# EAGLE design GPS-IoT-Mezzanine (EAGLE 9.6.2)
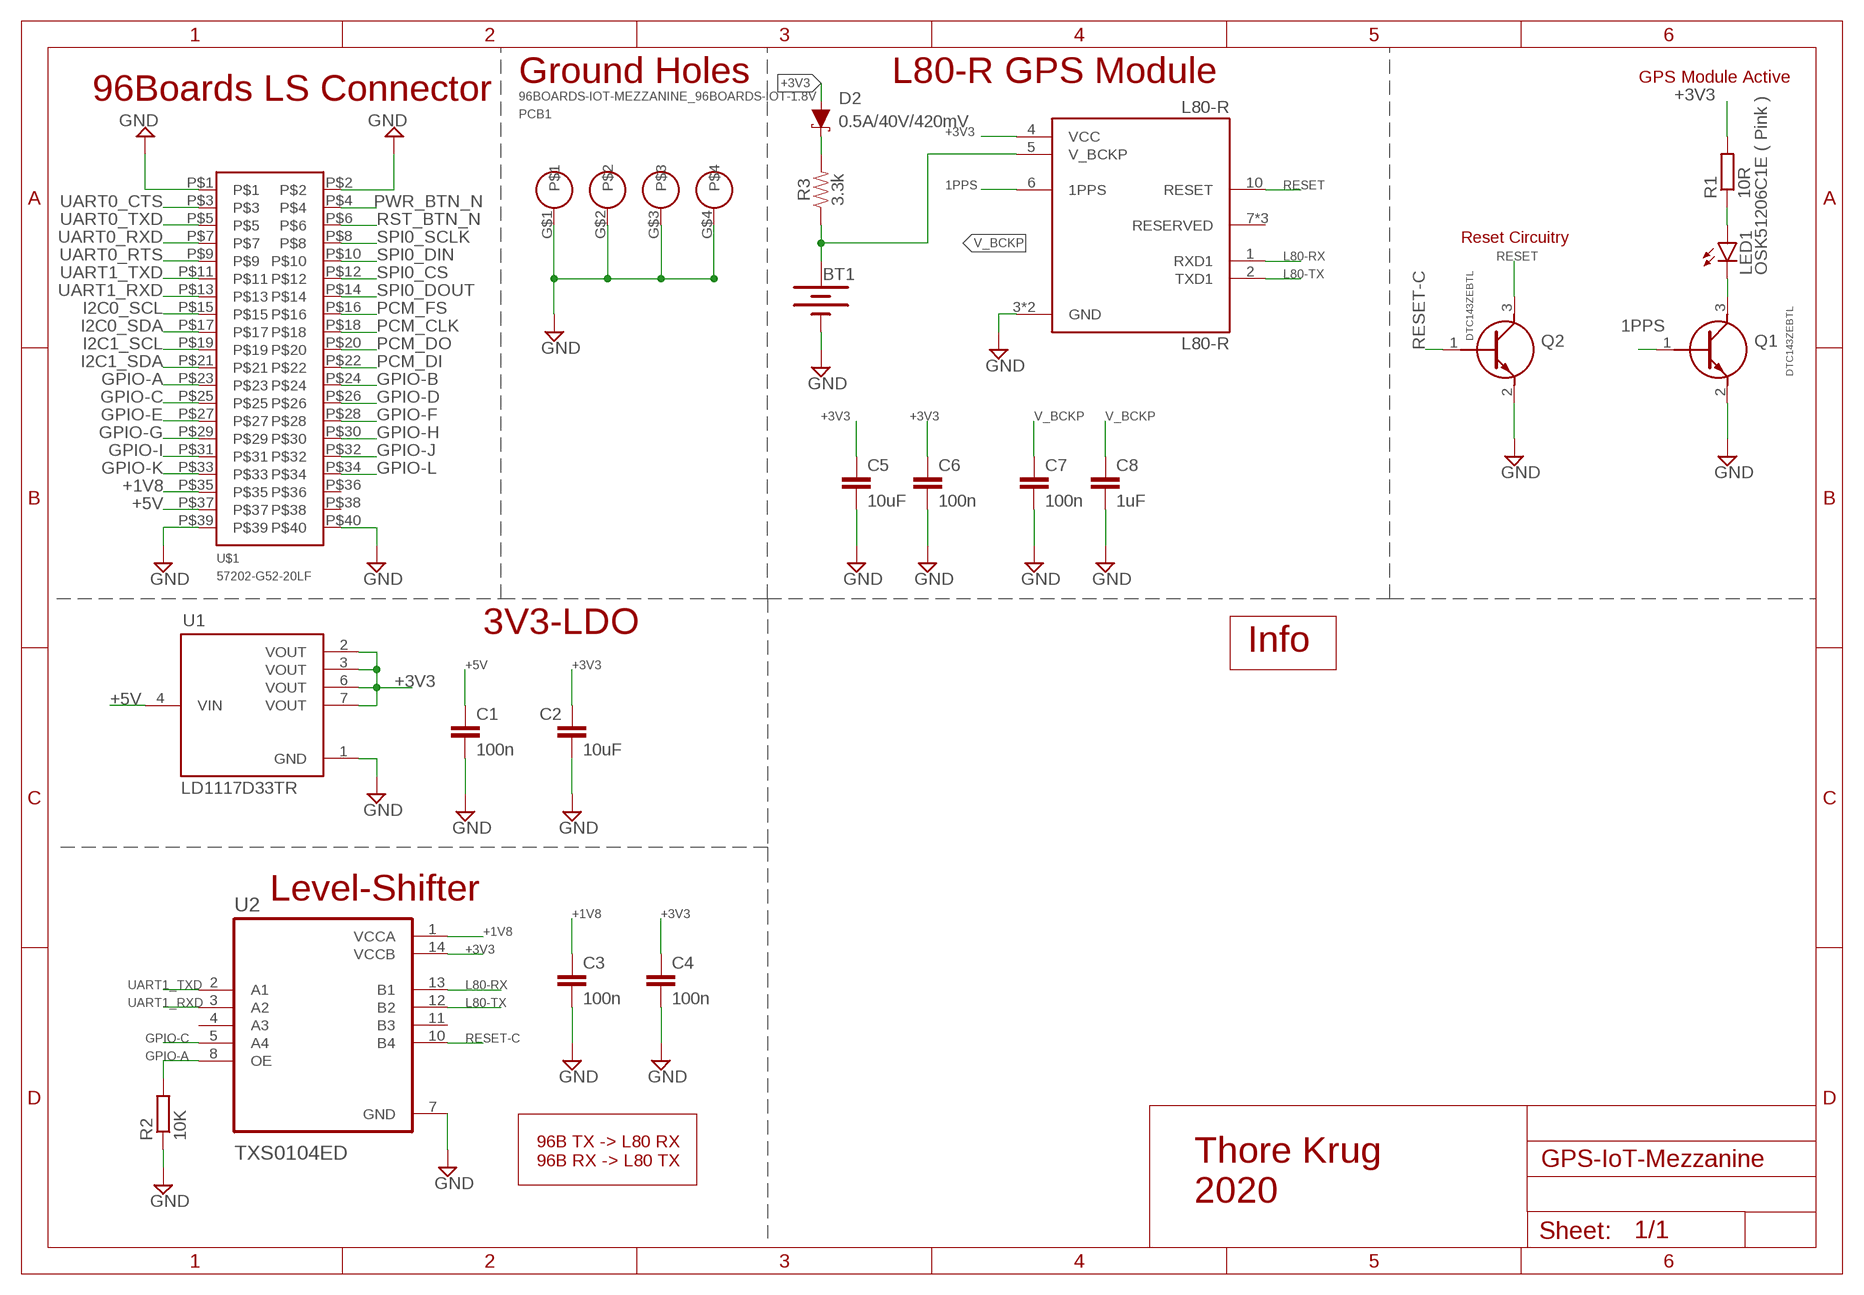
[diagram p0: schematic, sheet 1]

## Parts
BT1  6.8MM_COIN_CELL  ML414H_IV01E_BATTERY  [ML414H_IV01E]
C1  100n  C-EUC0603  [C0603]
C2  10uF  C-EUC0603  [C0603]
C3  100n  C-EUC0603  [C0603]
C4  100n  C-EUC0603  [C0603]
C5  10uF  C-EUC0603  [C0603]
C6  100n  C-EUC0603  [C0603]
C7  100n  C-EUC0603  [C0603]
C8  1uF  C-EUC0603  [C0603]
D2  0.5A/40V/420mV  DIODE-SCHOTTKY-PMEG4005EJ  [SOD-323]
L80-R  L80-R  [XCVR_L80-R]
LED1  OSK51206C1E ( Pink )  LEDCHIPLED_1206  [CHIPLED_1206]
PCB1  96BOARDS-IOT-MEZZANINE_96BOARDS-IOT-1.8V  [96BOARDS-IOT-MEZZANINE_96BOARDS-IOT-1.8V]
Q1  DTC143ZEBTL  [SOTFL50P160X85-3N]
Q2  DTC143ZEBTL  [SOTFL50P160X85-3N]
R1  10R  R-EU_R1206  [R1206]
R2  10K  R-EU_R0603  [R0603]
R3  3.3k  3.3KOHM-0603-1/10W-1%  [0603]
U1  LD1117D33TR  [SOIC127P600X175-8N]
U2  TXS0104ED  [SOIC127P600X175-14N]
U$1  57202-G52-20LF  [57202-G52-20LF]

## Nets
1PPS: L80-R.6(1PPS) Q1.1(B)
+1V8: C3.1 U2.1(VCCA) U$1.P$35
+3V3: C2.1 C4.1 C5.1 C6.1 D2.A L80-R.4(VCC) R1.2 U1.2(VOUT) U1.3(VOUT) U1.6(VOUT) U1.7(VOUT) U2.14(VCCB)
+5V: C1.1 U1.4(VIN) U$1.P$37
GND: BT1.- C1.2 C2.2 C3.2 C4.2 C5.2 C6.2 C7.2 C8.2 L80-R.3(GND) L80-R.12(GND) PCB1.G$1 PCB1.G$2 PCB1.G$3 PCB1.G$4 Q1.2(E) Q2.2(E) R2.1 U1.1(GND) U2.7(GND) U$1.P$1 U$1.P$2 U$1.P$39 U$1.P$40
GPIO-A: R2.2 U2.8(OE) U$1.P$23
GPIO-B: U$1.P$24
GPIO-C: U2.5(A4) U$1.P$25
GPIO-D: U$1.P$26
GPIO-E: U$1.P$27
GPIO-F: U$1.P$28
GPIO-G: U$1.P$29
GPIO-H: U$1.P$30
GPIO-I: U$1.P$31
GPIO-J: U$1.P$32
GPIO-K: U$1.P$33
GPIO-L: U$1.P$34
I2C0_SCL: U$1.P$15
I2C0_SDA: U$1.P$17
I2C1_SCL: U$1.P$19
I2C1_SDA: U$1.P$21
L80-RX: L80-R.1(RXD1) U2.13(B1)
L80-TX: L80-R.2(TXD1) U2.12(B2)
N$3: LED1.C Q1.3(C)
N$4: LED1.A R1.1
N$6: D2.C R3.2
PCM_CLK: U$1.P$18
PCM_DI: U$1.P$22
PCM_DO: U$1.P$20
PCM_FS: U$1.P$16
PWR_BTN_N: U$1.P$4
RESET: L80-R.10(RESET) Q2.3(C)
RESET-C: Q2.1(B) U2.10(B4)
RST_BTN_N: U$1.P$6
SPI0_CS: U$1.P$12
SPI0_DIN: U$1.P$10
SPI0_DOUT: U$1.P$14
SPI0_SCLK: U$1.P$8
UART0_CTS: U$1.P$3
UART0_RTS: U$1.P$9
UART0_RXD: U$1.P$7
UART0_TXD: U$1.P$5
UART1_RXD: U2.3(A2) U$1.P$13
UART1_TXD: U2.2(A1) U$1.P$11
V_BCKP: BT1.+ C7.1 C8.1 L80-R.5(V_BCKP) R3.1
Unconnected: L80-R.7(RESERVED) L80-R.8(RESERVED) L80-R.11(RESERVED) U2.4(A3) U2.11(B3) U$1.P$36 U$1.P$38

## Notes on the sheet
- Ground Holes | L80-R GPS Module | GPS Module Active
- 96Boards LS Connector
- Reset Circuitry
- 3V3-LDO
- Info
- Level-Shifter
- 96B TX -> L80 RX
  96B RX -> L80 TX
- Thore Krug 
  2020

## Library data of the parts
BT1 = SparkFun-Batteries:ML414H_IV01E_BATTERY: SEIKO ML414H-IV01E Reflowable Lithium Battery ML414H is a rechargeable, coin type battery with features such as Pb-free reflowable (Peak temperature: 260 C) and high temperature heat resistance. Battery Characteristics: 3.1V max voltage Voff is 2V 1mAH 3k series resistor with battery 72 hour charge time from 2.0-3.1V 2.3-2.8V initial charge; PROD_ID: BATT-14267
C1-C8 = rcl:C-EU: CAPACITOR, European symbol; SPICEPREFIX: C
D2 = SparkFun-DiscreteSemi:DIODE-SCHOTTKY: Schottky diode A Schottky diode is a semiconductor diode which has a low forward voltage drop and a very fast switching action.; PROD_ID: DIO-10955
L80-R = L80-R:L80-R; AVAILABILITY: Unavailable; DESCRIPTION: L80-R is an ultra compact GPS POT (Patch on Top) module with an embedded 15.0mm × 15.0mm × 4.0mm patch antenna; MF: Quectel; MP: L80-R; PACKAGE: None; PRICE: None
LED1 = led:LED: LED OSRAM: - CHIPLED LG R971, LG N971, LY N971, LG Q971, LY Q971, LO R971, LY R971 LH N974, LH R974 LS Q976, LO Q976, LY Q976 LO Q996 - Hyper CHIPLED LW Q18S LB Q993, LB Q99A, LB R99A - SideLED LS A670, LO A670, LY A670, LG A670, LP A670 LB A673, LV A673, LT A673, LW A673 LH A674 LY A675 LS A676, LA A676, LO A676, LY A676, LW A676 LS A679, LY A679, LG A679 - Hyper Micro SIDELED® LS Y876, LA Y876, LO Y876, LY Y876 LT Y87S - SmartLED LW L88C, LW L88S LB L89C, LB L89S, LG L890 LS L89K, LO L89K, LY L89K LS L896, LA L896, LO L896, LY L896 - TOPLED LS T670, LO T670, LY T670, LG T670, LP T670 LSG T670, LSP T670, LSY T670, LOP T670, LYG T670 LG T671, LOG T671, LSG T671 LB T673, LV T673, LT T673, LW T673 LH T674 LS T676, LA T676, LO T676, LY T676, LB T676, LH T676, LSB T676, LW T676 LB T67C, LV T67C, LT T67C, LS T67K, LO T67K, LY T67K, LW E67C LS E67B, LA E67B, LO E67B, LY E67B, LB E67C, LV E67C, LT E67C LW T67C LS T679, LY T679, LG T679 LS T770, LO T770, LY T770, LG T770, LP T770 LB T773, LV T773, LT T773, LW T773 LH T774 LS E675, LA E675, LY E675, LS T675 LS T776, LA T776, LO T776, LY T776, LB T776 LHGB T686 LT T68C, LB T68C - Hyper Mini TOPLED® LB M676 - Mini TOPLED Santana® LG M470 LS M47K, LO M47K, LY M47K Source: http://www.osram.convergy.de LUXEON: - LUMILED® LXK2-PW12-R00, LXK2-PW12-S00, LXK2-PW14-U00, LXK2-PW14-V00 LXK2-PM12-R00, LXK2-PM12-S00, LXK2-PM14-U00 LXK2-PE12-Q00, LXK2-PE12-R00, LXK2-PE12-S00, LXK2-PE14-T00, LXK2-PE14-U00 LXK2-PB12-K00, LXK2-PB12-L00, LXK2-PB12-M00, LXK2-PB14-N00, LXK2-PB14-P00, LXK2-PB14-Q00 LXK2-PR12-L00, LXK2-PR12-M00, LXK2-PR14-Q00, LXK2-PR14-R00 LXK2-PD12-Q00, LXK2-PD12-R00, LXK2-PD12-S00 LXK2-PH12-R00, LXK2-PH12-S00 LXK2-PL12-P00, LXK2-PL12-Q00, LXK2-PL12-R00 Source: www.luxeon.com KINGBRIGHT: KA-3528ASYC Source: www.kingbright.com
PCB1 = GPS-IoT-Mezzanine:96BOARDS-IOT-MEZZANINE_96BOARDS-IOT-1.8V
Q1 Q2 = SamacSys_Parts:DTC143ZEBTL: ROHM, DTC143ZEBTL NPN Digital Transistor, 100 mA 50 V 4.7 k, Ratio Of 10, 3-Pin SC-89 Source: Datasheet <https://www.rohm.com/datasheet/DTC143ZEB/dtc143zebtl-e>; ARROW_PART_NUMBER: DTC143ZEBTL; ARROW_PRICE-STOCK: https://www.arrow.com/en/products/dtc143zebtl/rohm-semiconductor; DESCRIPTION: ROHM, DTC143ZEBTL NPN Digital Transistor, 100 mA 50 V 4.7 k, Ratio Of 10, 3-Pin SC-89; HEIGHT: 0.85mm; MANUFACTURER_NAME: ROHM Semiconductor; MANUFACTURER_PART_NUMBER: DTC143ZEBTL; MOUSER_PART_NUMBER: 755-DTC143ZEBTL; MOUSER_PRICE-STOCK: https://www.mouser.co.uk/ProductDetail/ROHM-Semiconductor/DTC143ZEBTL?qs=IsRgwgmxh6%252Bn%252Bp0edl8N%2Fw%3D%3D
R1 R2 = rcl:R-EU_: RESISTOR, European symbol; SPICEPREFIX: R
R3 = SparkFun-Resistors:3.3KOHM: 3.3kΩ resistor A resistor is a passive two-terminal electrical component that implements electrical resistance as a circuit element. Resistors act to reduce current flow, and, at the same time, act to lower voltage levels within circuits. - Wikipedia; PROD_ID: RES-07851
U1 = LD1117D33TR:LD1117D33TR: LD1117 Series 1300 mA Low Drop Fixed Positive Voltage Regulator - SOIC-8 Check prices <https://pricing.snapeda.com/parts/LD1117D33TR/STMicroelectronics/view-part?ref=eda>; AVAILABILITY: Warning; DESCRIPTION: Linear Voltage Regulator IC 1 Output 800mA 8-SO; MF: STMicroelectronics; MP: LD1117D33TR; PACKAGE: SO-8 STMicroelectronics; PRICE: None; PURCHASE-URL: https://pricing.snapeda.com/search/part/LD1117D33TR/?ref=eda
U2 = TXS0104ED:TXS0104ED: Check prices <https://pricing.snapeda.com/parts/TXS0104ED/Texas%20Instruments/view-part?ref=eda>; AVAILABILITY: Good; DESCRIPTION: 4-Bit Bidirectional Voltage-Level Shifter for Open-Drain and Push-Pull Applications 14-SOIC -40 to 85; MF: Texas Instruments; MP: TXS0104ED; PACKAGE: SOIC-14 Texas Instruments; PRICE: None; PURCHASE-URL: https://pricing.snapeda.com/search/part/TXS0104ED/?ref=eda
U$1 = 96Boards-IoT-Mezzanine:57202-G52-20LF

## Net classes
0 default: clearance 0.205 mm

## Board
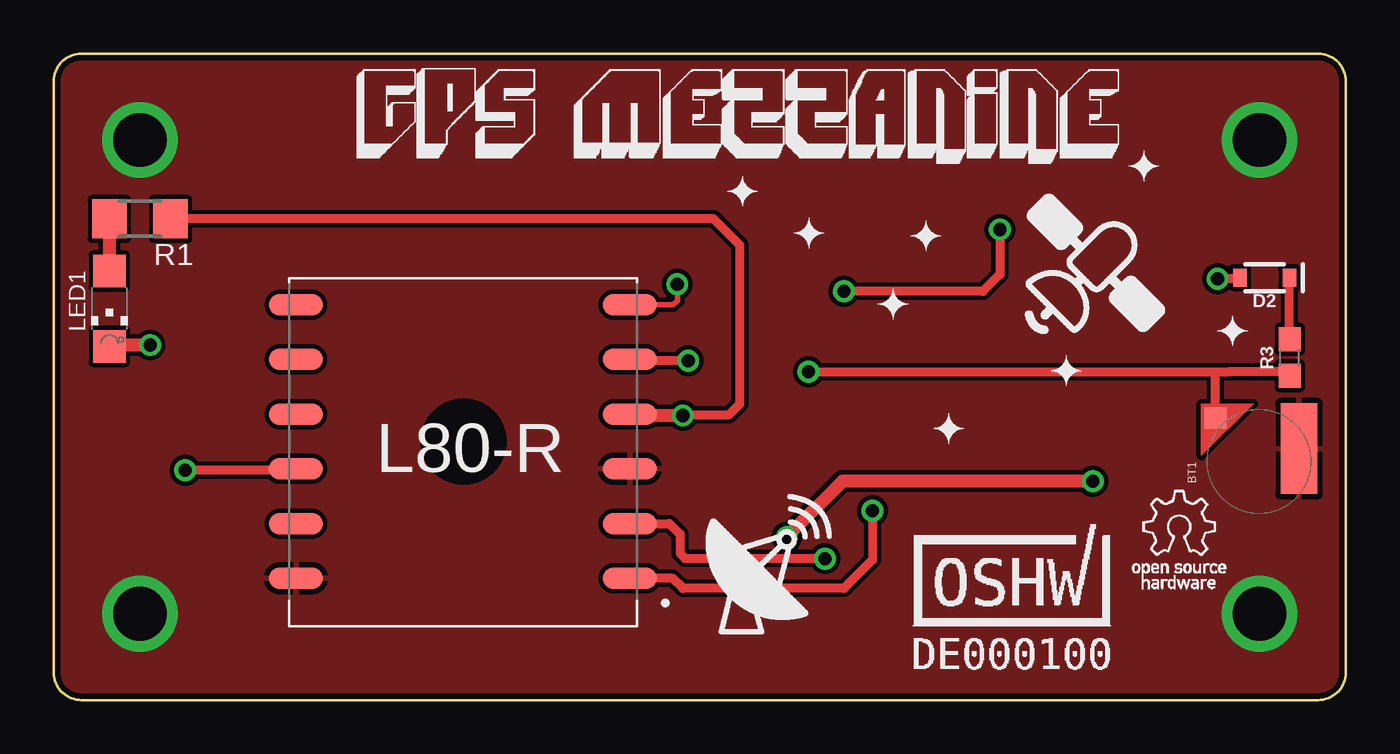
[diagram p1: board, top side]
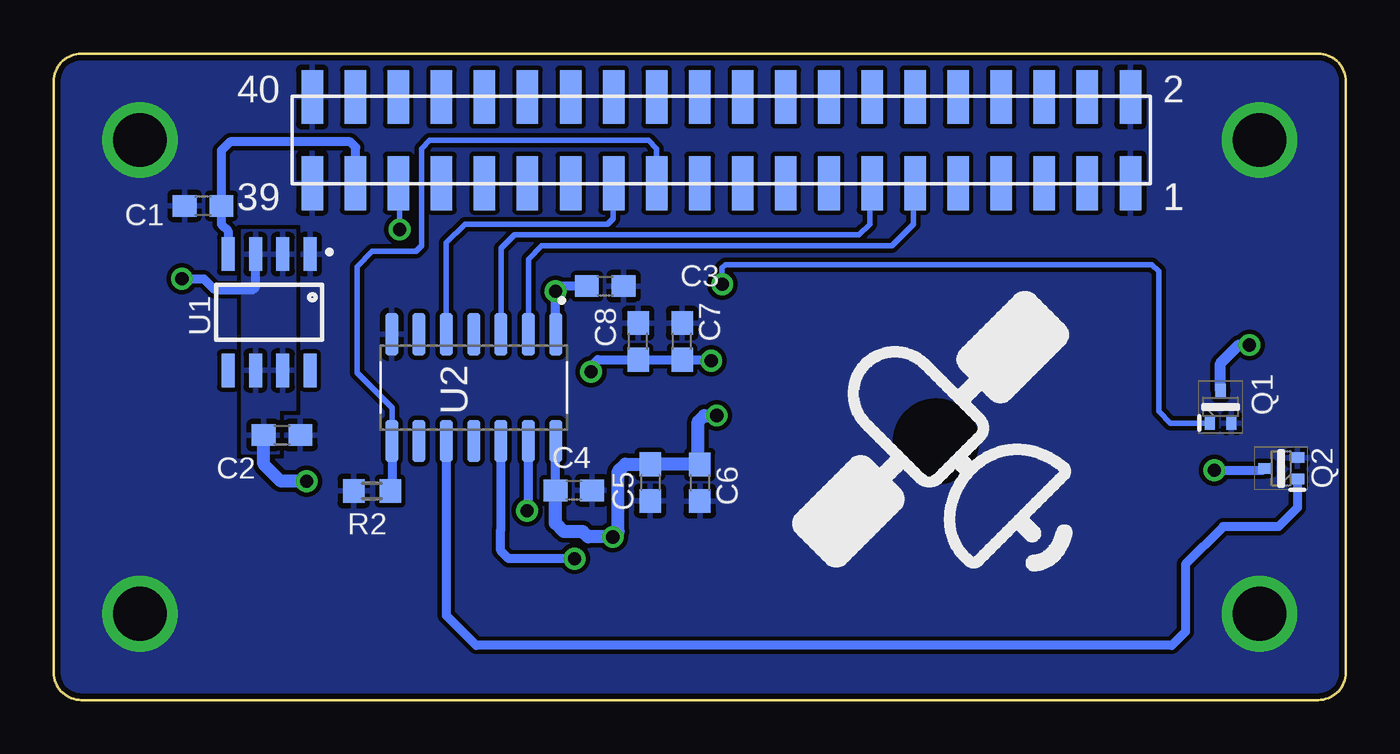
[diagram p2: board, bottom side, seen from below]

Size 60 x 30 mm. Coordinates in mm from the lower left corner, seen from the top.
Copper layers (1*16): Top 0.035mm / dielectric 1.5mm / Bottom 0.035mm
Design rules "default *": minimum track width 10mil, minimum drill 24mil, track to track 8mil, track to pad 8mil, pad to pad 8mil, via to via 8mil, smd to smd 8mil, copper to edge 10mil, drill to drill 8mil, minimum pad ring 10mil, minimum via ring 8mil, stop-mask expansion 4mil, vias tented up to drill 0mil, thermal gap 10mil
tRestrict: area 17,10 to 21,14
bRestrict: area 17,10 to 21,14

### Footprints (pad centres in the part's own frame; a part is rotated, then mirrored left to right if it is on the bottom)
ML414H_IV01E = smd 1 x 1: + 2.022,2.032 | smd 4.2 x 1.7: - 0.6,-1.85
C0603 = smd 1.1 x 1: 1 -0.85,0; 2 0.85,0
SOD-323 = smd 0.63 x 0.83: A 1.15,0; C -1.15,0
XCVR_L80-R = smd 2.5 x 1: 1 -7.75,6.35; 2 -7.75,3.81; 3 -7.75,1.27; 4 -7.75,-1.27; 5 -7.75,-3.81; 6 -7.75,-6.35; 7 7.75,-6.35; 8 7.75,-3.81; 9 7.75,-1.27; 10 7.75,1.27; 11 7.75,3.81; 12 7.75,6.35
CHIPLED_1206 = smd 1.5 x 1.5: A 0,-1.75; C 0,1.75
96BOARDS-IOT-MEZZANINE_96BOARDS-IOT-1.8V = drill 2.5: G$1 4,4; G$2 56,4; G$3 56,26; G$4 4,26
SOTFL50P160X85-3N = smd 0.64 x 0.48: 1 -0.75,0.5; 2 -0.75,-0.5; 3 0.75,0
R1206 = smd 1.6 x 1.803: 1 -1.422,0; 2 1.422,0
R0603 = smd 1 x 1.1: 1 -0.85,0; 2 0.85,0
0603 = smd 1.1 x 1: 1 -0.85,0; 2 0.85,0
SOIC127P600X175-8N = smd 1.55 x 0.6: 1 -2.7,1.905; 2 -2.7,0.635; 3 -2.7,-0.635; 4 -2.7,-1.905; 5 2.7,-1.905; 6 2.7,-0.635; 7 2.7,0.635; 8 2.7,1.905
SOIC127P600X175-14N = smd 1.97 x 0.6: 1 -2.475,3.81; 2 -2.475,2.54; 3 -2.475,1.27; 4 -2.475,0; 5 -2.475,-1.27; 6 -2.475,-2.54; 7 -2.475,-3.81; 8 2.475,-3.81; 9 2.475,-2.54; 10 2.475,-1.27; 11 2.475,0; 12 2.475,1.27; 13 2.475,2.54; 14 2.475,3.81
57202-G52-20LF = smd 1 x 2.5: P$1 -19,2; P$2 -19,-2; P$3 -17,2; P$4 -17,-2; P$5 -15,2; P$6 -15,-2; P$7 -13,2; P$8 -13,-2; P$9 -11,2; P$10 -11,-2; P$11 -9,2; P$12 -9,-2; P$13 -7,2; P$14 -7,-2; P$15 -5,2; P$16 -5,-2; P$17 -3,2; P$18 -3,-2; P$19 -1,2; P$20 -1,-2; P$21 1,2; P$22 1,-2; P$23 3,2; P$24 3,-2; P$25 5,2; P$26 5,-2; P$27 7,2; P$28 7,-2; P$29 9,2; P$30 9,-2; P$31 11,2; P$32 11,-2; P$33 13,2; P$34 13,-2; P$35 15,2; P$36 15,-2; P$37 17,2; P$38 17,-2; P$39 19,2; P$40 19,-2

### Placement (x,y rotation side)
BT1  55.98,11.07 90 top
C1  53.07,22.94 180 bottom
C2  49.4,12.3 0 bottom
C3  34.39,19.22 0 bottom
C4  35.85,9.74 0 bottom
C5  32.3,10.1 270 bottom
C6  30,10.09 270 bottom
C7  30.82,16.65 90 bottom
C8  32.86,16.65 90 bottom
D2  56.24,19.61 180 top
L80-R  19,12 180 top
LED1  2.58,18.17 180 top
PCB1  0,0 0 top
Q1  5.81,13.61 90 bottom
Q2  2.99,10.75 180 bottom
R1  4,22.34 0 top
R2  45.22,9.71 0 bottom
R3  57.4,15.9 90 top
U1  50,18 270 bottom
U2  40.5,14.5 270 bottom
U$1  29,26 180 bottom

### Tracks (layer width: path | path; a pad name or v marks a point on that pad's centre or on a via)
1PPS  (via drill 0.61)
  Top 0.254: L80-R.6 28.76,18.35 28.96,18.54 v28.96,19.3
  Bottom 0.254: v28.96,19.3 28.96,20.07 28.8,20.22 8.99,20.22 8.69,19.91 8.69,13.41 8.13,12.86 Q1.1
+1V8  (via drill 0.61)
  Top 0.406: v43.94,21.84 43.94,19.76 43.16,18.98 v36.69,18.98
  Bottom 0.254: v43.94,21.84 43.94,23.94 U$1.P$35
  Bottom 0.406: C3.1 36.45,19.22 v36.69,18.98 U2.1
+3V3  (via drill 0.61)
  Top 0.406: D2.A 55.03,19.56 v54.05,19.56 | v29.21,13.21 29.25,13.25 31.36,13.25 31.87,13.75 31.87,21.12 30.65,22.34 R1.2
  Top 0.61: v29.21,13.21 26.81,13.21 L80-R.4 | v34.04,7.57 36.63,10.16 v48.26,10.16
  Bottom 0.406: C4.1 36.7,9.98 36.7,12.02 U2.14 | C6.1 30.07,11.01 | 32.27,10.91 C5.1 | v54.05,19.56 53.04,19.56 52.53,19.05 50.75,19.05 50.63,19.16 U1.3
  Bottom 0.61: v29.21,13.21 29.79,13.21 30.07,12.93 30.07,11.01 | C6.1 32.24,10.94 32.27,10.91 | v48.26,10.16 49.45,10.16 50.25,10.96 C2.1 | C5.1 33.46,10.95 33.78,10.62 33.78,7.82 v34.04,7.57 35.18,7.57 35.44,7.82 36.32,7.82 36.71,8.2 36.71,9.98 36.7,9.98
  pour Bottom: 48.77,21.84 51.28,21.84 51.28,11.43 49.53,11.43 49.53,13.46 48.77,13.46
+5V
  Bottom 0.406: U$1.P$37 45.97,24.03 45.97,25.65 46.23,25.91 51.82,25.91 52.22,25.51 C1.1 52.22,22.09 51.9,21.78 U1.4
GND
  pour Bottom (rank 2): 0,0 0,29.97 59.94,29.97 59.94,0
  pour Top: 0,0 0,29.97 59.94,29.97 59.94,0
GPIO-A
  Bottom 0.254: 44.3,12.01 44.3,13.56 45.92,15.19 45.92,20.12 45.21,20.83 43.18,20.83 42.93,21.08 42.93,25.6 42.55,25.98 32.39,25.98 32,25.6 U$1.P$23
  Bottom 0.406: R2.2 44.3,9.78 44.3,12.01 U2.8
GPIO-C
  Bottom 0.254: U$1.P$25 34.04,23.96 34.04,22.35 34.29,22.1 40.89,22.1 41.77,21.22 U2.5
L80-RX  (via drill 0.61)
  Top 0.406: v38.02,8.79 38.02,6.5 36.7,5.18 29.21,5.18 28.74,5.65 L80-R.1
  Bottom 0.406: v38.02,8.79 37.97,8.84 37.97,12.01 U2.13
L80-TX  (via drill 0.61)
  Top 0.406: L80-R.2 28.59,8.19 29.09,7.7 29.09,6.81 29.31,6.58 35.63,6.58 35.64,6.56 v35.82,6.56
  Bottom 0.406: U2.12 39.23,7.91 39.25,7.9 39.25,6.93 38.88,6.56 v35.82,6.56
N$3  (via drill 0.61)
  Top 0.61: LED1.C 2.65,16.48 v4.47,16.48
  Bottom 0.508: v4.47,16.48 4.95,16.48 5.81,15.63 Q1.3
N$4
  Top 0.61: R1.1 LED1.A
N$6
  Top 0.406: R3.2 57.39,16.77 D2.C
RESET  (via drill 0.61)
  Top 0.406: L80-R.10 11.19,10.67 v6.1,10.67
  Bottom 0.406: v6.1,10.67 3.83,10.67 Q2.3
RESET-C
  Bottom 0.406: U2.10 41.77,3.92 40.39,2.54 8.08,2.54 7.44,3.18 7.44,6.3 5.69,8.05 3.12,8.05 2.24,8.93 Q2.1
UART1_RXD
  Bottom 0.254: U$1.P$13 22.1,23.9 22.1,22.1 22.61,21.59 38.61,21.59 39.23,20.97 U2.3
UART1_TXD
  Bottom 0.254: U$1.P$11 20.07,23.93 20.07,22.1 21.08,21.08 37.34,21.08 37.96,20.46 U2.2
V_BCKP  (via drill 0.61)
  Top 0.406: R3.1 57.21,15.24 54.56,15.24 53.98,15.24 | v29.46,15.75 26.81,15.75 L80-R.5 | v35.05,15.24 36.5,15.24 53.98,15.24 | 53.98,15.24 53.95,15.21 BT1.+
  Bottom 0.406: v29.46,15.75 29.52,15.8 C7.1 C8.1 34.75,15.8 35.05,15.49 v35.05,15.24